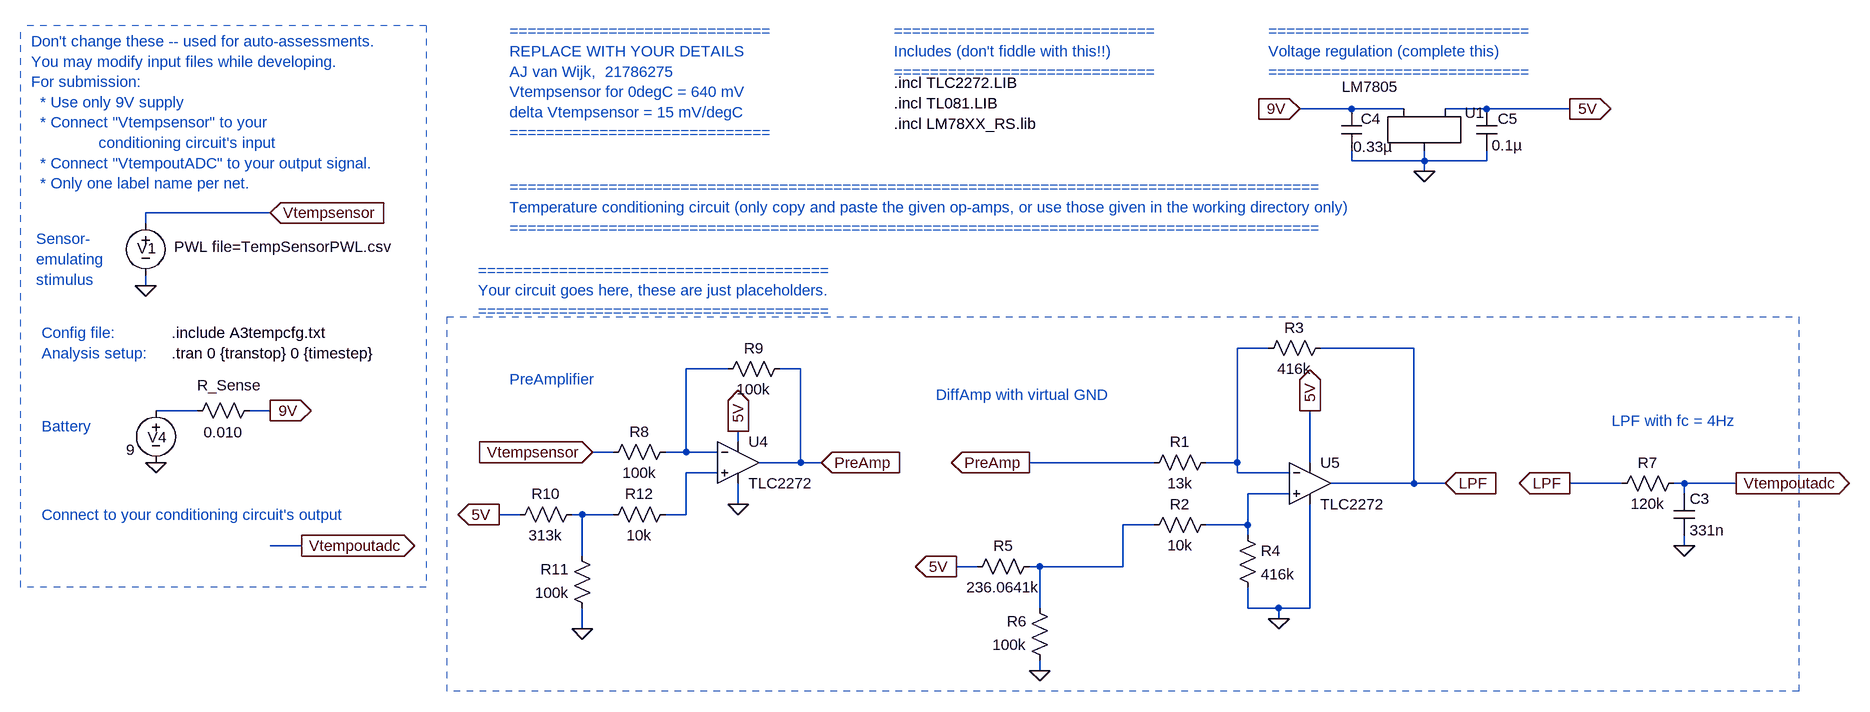
[diagram p0: schematic E344_A3_temp.asc]
E344_A3_temp.asc, the LTspice schematic file:
Version 4
SHEET 1 1824 708
WIRE -256 -1280 -336 -1280
WIRE -176 -1280 -256 -1280
WIRE -48 -1280 -112 -1280
WIRE 80 -1280 -48 -1280
WIRE -256 -1200 -256 -1216
WIRE -144 -1200 -144 -1216
WIRE -144 -1200 -256 -1200
WIRE -48 -1200 -48 -1216
WIRE -48 -1200 -144 -1200
WIRE -144 -1184 -144 -1200
WIRE -1920 -1120 -2112 -1120
WIRE -2112 -1104 -2112 -1120
WIRE -2112 -1008 -2112 -1024
WIRE -384 -912 -432 -912
WIRE -160 -912 -304 -912
WIRE -1216 -880 -1280 -880
WIRE -1104 -880 -1136 -880
WIRE -2032 -816 -2096 -816
WIRE -1920 -816 -1952 -816
WIRE -1200 -768 -1200 -784
WIRE -1392 -752 -1424 -752
WIRE -1280 -752 -1280 -880
WIRE -1280 -752 -1312 -752
WIRE -1232 -752 -1280 -752
WIRE -1104 -736 -1104 -880
WIRE -1104 -736 -1168 -736
WIRE -1072 -736 -1104 -736
WIRE -560 -736 -752 -736
WIRE -432 -736 -432 -912
WIRE -432 -736 -480 -736
WIRE -320 -736 -320 -816
WIRE -1232 -720 -1280 -720
WIRE -432 -720 -432 -736
WIRE -352 -720 -432 -720
WIRE -160 -704 -160 -912
WIRE -160 -704 -288 -704
WIRE -112 -704 -160 -704
WIRE 160 -704 80 -704
WIRE 256 -704 240 -704
WIRE 336 -704 256 -704
WIRE -352 -688 -416 -688
WIRE 256 -688 256 -704
WIRE -1200 -672 -1200 -704
WIRE -1536 -656 -1568 -656
WIRE -1440 -656 -1456 -656
WIRE -1392 -656 -1440 -656
WIRE -1280 -656 -1280 -720
WIRE -1280 -656 -1312 -656
WIRE -560 -640 -608 -640
WIRE -416 -640 -416 -688
WIRE -416 -640 -480 -640
WIRE -416 -624 -416 -640
WIRE -1872 -608 -1920 -608
WIRE 256 -608 256 -624
WIRE -1440 -592 -1440 -656
WIRE -832 -576 -864 -576
WIRE -736 -576 -752 -576
WIRE -608 -576 -608 -640
WIRE -608 -576 -736 -576
WIRE -736 -512 -736 -576
WIRE -416 -512 -416 -544
WIRE -368 -512 -416 -512
WIRE -320 -512 -320 -672
WIRE -320 -512 -368 -512
WIRE -368 -496 -368 -512
WIRE -1440 -480 -1440 -512
WIRE -736 -416 -736 -432
FLAG -2112 -1008 0
FLAG -1920 -1120 Vtempsensor
IOPIN -1920 -1120 In
FLAG -1920 -816 9V
IOPIN -1920 -816 Out
FLAG -2096 -736 0
FLAG -336 -1280 9V
IOPIN -336 -1280 In
FLAG -144 -1184 0
FLAG 80 -1280 5V
IOPIN 80 -1280 Out
FLAG -1872 -608 Vtempoutadc
IOPIN -1872 -608 Out
FLAG -368 -496 0
FLAG -736 -416 0
FLAG -1200 -784 5V
IOPIN -1200 -784 Out
FLAG -864 -576 5V
IOPIN -864 -576 Out
FLAG -320 -816 5V
IOPIN -320 -816 Out
FLAG -1440 -480 0
FLAG -1568 -656 5V
IOPIN -1568 -656 Out
FLAG -1200 -672 0
FLAG -752 -736 PreAmp
IOPIN -752 -736 Out
FLAG -1072 -736 PreAmp
IOPIN -1072 -736 In
FLAG -112 -704 LPF
IOPIN -112 -704 In
FLAG 256 -608 0
FLAG 80 -704 LPF
IOPIN 80 -704 Out
FLAG -1424 -752 Vtempsensor
IOPIN -1424 -752 In
FLAG 336 -704 Vtempoutadc
IOPIN 336 -704 Out
SYMBOL voltage -2112 -1120 R0
WINDOW 123 0 0 Left 0
WINDOW 39 0 0 Left 0
WINDOW 3 44 52 Left 2
WINDOW 0 -13 54 Left 2
SYMATTR Value PWL file=TempSensorPWL.csv
SYMATTR InstName V1
SYMBOL voltage -2096 -832 R0
WINDOW 123 24 44 Left 2
WINDOW 39 0 0 Left 0
WINDOW 3 -46 76 Left 2
WINDOW 0 -13 57 Left 2
SYMATTR Value 9
SYMATTR InstName V4
SYMBOL res -1936 -832 R90
WINDOW 0 -7 47 VBottom 2
WINDOW 3 34 56 VTop 2
SYMATTR InstName R_Sense
SYMATTR Value 0.010
SYMBOL LM7805 -144 -1264 R0
WINDOW 3 -83 -66 Top 2
SYMATTR InstName U1
SYMBOL res -464 -752 R90
WINDOW 0 0 56 VBottom 2
WINDOW 3 32 56 VTop 2
SYMATTR InstName R1
SYMATTR Value 13k
SYMBOL res -464 -656 R90
WINDOW 0 0 56 VBottom 2
WINDOW 3 32 56 VTop 2
SYMATTR InstName R2
SYMATTR Value 10k
SYMBOL res -288 -928 R90
WINDOW 0 0 56 VBottom 2
WINDOW 3 32 56 VTop 2
SYMATTR InstName R3
SYMATTR Value 416k
SYMBOL res -432 -640 R0
SYMATTR InstName R4
SYMATTR Value 416k
SYMBOL res -736 -592 R90
WINDOW 0 0 56 VBottom 2
WINDOW 3 32 56 VTop 2
SYMATTR InstName R5
SYMATTR Value 236.0641k
SYMBOL res -720 -416 R180
WINDOW 0 36 76 Left 2
WINDOW 3 36 40 Left 2
SYMATTR InstName R6
SYMATTR Value 100k
SYMBOL res 256 -720 R90
WINDOW 0 0 56 VBottom 2
WINDOW 3 32 56 VTop 2
SYMATTR InstName R7
SYMATTR Value 120k
SYMBOL res -1296 -768 R90
WINDOW 0 0 56 VBottom 2
WINDOW 3 32 56 VTop 2
SYMATTR InstName R8
SYMATTR Value 100k
SYMBOL res -1120 -896 R90
WINDOW 0 0 56 VBottom 2
WINDOW 3 32 56 VTop 2
SYMATTR InstName R9
SYMATTR Value 100k
SYMBOL res -1440 -672 R90
WINDOW 0 0 56 VBottom 2
WINDOW 3 32 56 VTop 2
SYMATTR InstName R10
SYMATTR Value 313k
SYMBOL res -1424 -496 R180
WINDOW 0 36 76 Left 2
WINDOW 3 36 40 Left 2
SYMATTR InstName R11
SYMATTR Value 100k
SYMBOL res -1296 -672 R90
WINDOW 0 0 56 VBottom 2
WINDOW 3 32 56 VTop 2
SYMATTR InstName R12
SYMATTR Value 10k
SYMBOL cap 240 -688 R0
SYMATTR InstName C3
SYMATTR Value 331n
SYMBOL cap -272 -1280 R0
WINDOW 3 19 58 Left 2
WINDOW 0 30 15 Left 2
SYMATTR Value 0.33µ
SYMATTR InstName C4
SYMBOL cap -64 -1280 R0
WINDOW 0 33 15 Left 2
SYMATTR InstName C5
SYMATTR Value 0.1µ
SYMBOL opamp2 -1200 -800 R0
SYMATTR InstName U4
SYMATTR Value TLC2272
SYMATTR SpiceModel TLC2272
SYMBOL opamp2 -320 -768 R0
SYMATTR InstName U5
SYMATTR Value TLC2272
SYMATTR SpiceModel TLC2272
TEXT -2072 -904 Left 2 !.tran 0 {transtop} 0 {timestep}
TEXT -2072 -936 Left 2 !.include A3tempcfg.txt
TEXT -2288 -1384 Left 2 ;Don't change these -- used for auto-assessments.\nYou may modify input files while developing.\nFor submission: \n  * Use only 9V supply \n  * Connect "Vtempsensor" to your \n               conditioning circuit's input\n  * Connect "VtempoutADC" to your output signal.\n  * Only one label name per net.
TEXT -2272 -936 Left 2 ;Config file:
TEXT -2272 -904 Left 2 ;Analysis setup:
TEXT -2272 -792 Left 2 ;Battery
TEXT -2280 -1080 Left 2 ;Sensor-\nemulating \nstimulus
TEXT -1552 -1400 Left 2 ;=============================\nREPLACE WITH YOUR DETAILS\nAJ van Wijk,  21786275\nVtempsensor for 0degC = 640 mV\ndelta Vtempsensor = 15 mV/degC\n=============================
TEXT -1552 -1160 Left 2 ;==========================================================================================\nTemperature conditioning circuit (only copy and paste the given op-amps, or use those given in the working directory only)\n==========================================================================================
TEXT -384 -1400 Left 2 ;=============================\nVoltage regulation (complete this)\n=============================
TEXT -960 -1320 Left 2 !.incl TLC2272.LIB\n.incl TL081.LIB\n.incl LM78XX_RS.lib
TEXT -2272 -656 Left 2 ;Connect to your conditioning circuit's output
TEXT -960 -1400 Left 2 ;=============================\nIncludes (don't fiddle with this!!)\n=============================
TEXT -1600 -1032 Left 2 ;=======================================\nYour circuit goes here, these are just placeholders.\n=======================================
TEXT 144 -800 Left 2 ;LPF with fc = 4Hz
TEXT -1552 -864 Left 2 ;PreAmplifier
TEXT -896 -840 Left 2 ;DiffAmp with virtual GND
LINE Normal -2304 -544 -2304 -1408 1
LINE Normal -1680 -1408 -1680 -544 1
LINE Normal -1680 -544 -2304 -544 1
LINE Normal -1680 -1408 -2304 -1408 1
RECTANGLE Normal 432 -384 -1648 -960 1

The netlist it stands for:
* E344_A3_temp.asc
V1 Vtempsensor 0 PWL file=TempSensorPWL.csv
V4 N003 0 9
R_Sense 9V N003 0.010
XU1 9V 0 5V LM7805
R1 N001 PreAmp 13k
R2 N005 N007 10k
R3 LPF N001 416k
R4 N005 0 416k
R5 N007 5V 236.0641k
R6 0 N007 100k
R7 Vtempoutadc LPF 120k
R8 N002 Vtempsensor 100k
R9 PreAmp N002 100k
R10 N006 5V 313k
R11 0 N006 100k
R12 N004 N006 10k
C3 Vtempoutadc 0 331n
C4 9V 0 0.33µ
C5 5V 0 0.1µ
XU4 N004 N002 5V 0 PreAmp TLC2272 TLC2272  ; pins In+ In- V+ V- OUT
XU5 N005 N001 5V 0 LPF TLC2272 TLC2272  ; pins In+ In- V+ V- OUT
.tran 0 {transtop} 0 {timestep}
.include A3tempcfg.txt
* Don't change these -- used for auto-assessments.
* You may modify input files while developing.
* For submission:
*   * Use only 9V supply
*   * Connect "Vtempsensor" to your
*                conditioning circuit's input
*   * Connect "VtempoutADC" to your output signal.
*   * Only one label name per net.
* Config file:
* Analysis setup:
* Battery
* Sensor-
* emulating
* stimulus
* =============================
* REPLACE WITH YOUR DETAILS
* AJ van Wijk,  21786275
* Vtempsensor for 0degC = 640 mV
* delta Vtempsensor = 15 mV/degC
* =============================
* ==========================================================================================
* Temperature conditioning circuit (only copy and paste the given op-amps, or use those given in the working directory only)
* ==========================================================================================
* =============================
* Voltage regulation (complete this)
* =============================
.incl TLC2272.LIB
.incl TL081.LIB
.incl LM78XX_RS.lib
* Connect to your conditioning circuit's output
* =============================
* Includes (don't fiddle with this!!)
* =============================
* =======================================
* Your circuit goes here, these are just placeholders.
* =======================================
* LPF with fc = 4Hz
* PreAmplifier
* DiffAmp with virtual GND
.backanno
.end